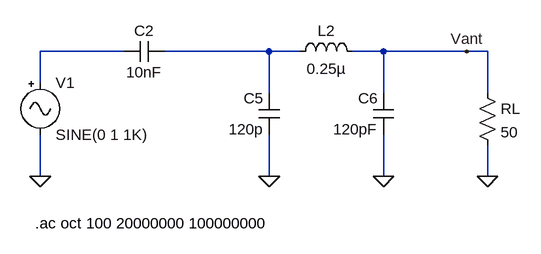
[diagram p0: schematic Draft1.asc]
Draft1.asc, the LTspice schematic file:
Version 4
SHEET 1 932 680
WIRE 320 288 192 288
WIRE 544 288 384 288
WIRE 592 288 544 288
WIRE 720 288 672 288
WIRE 848 288 720 288
WIRE 880 288 848 288
WIRE 192 336 192 288
WIRE 544 352 544 288
WIRE 720 352 720 288
WIRE 880 352 880 288
WIRE 192 480 192 416
WIRE 544 480 544 416
WIRE 720 480 720 416
WIRE 880 480 880 432
FLAG 192 480 0
FLAG 544 480 0
FLAG 720 480 0
FLAG 848 288 Vant
FLAG 880 480 0
SYMBOL cap 384 272 R90
WINDOW 0 0 32 VBottom 2
WINDOW 3 32 32 VTop 2
SYMATTR InstName C2
SYMATTR Value 10nF
SYMBOL cap 560 416 R180
WINDOW 0 24 56 Left 2
WINDOW 3 24 8 Left 2
SYMATTR InstName C5
SYMATTR Value 120p
SYMBOL cap 736 416 R180
WINDOW 0 24 56 Left 2
WINDOW 3 24 8 Left 2
SYMATTR InstName C6
SYMATTR Value 120pF
SYMBOL Ind 576 304 R270
WINDOW 0 32 56 VTop 2
WINDOW 3 5 56 VBottom 2
SYMATTR InstName L2
SYMATTR Value 0.25µ
SYMBOL Misc/signal 192 320 R0
SYMATTR InstName V1
SYMATTR Value2 AC 1 0
SYMBOL Res 864 336 R0
SYMATTR InstName RL
SYMATTR Value 50
TEXT 184 552 Left 2 !.ac oct 100 20000000 100000000

The netlist it stands for:
* Draft1.asc
C2 N002 N001 10nF
C5 0 N002 120p
C6 0 Vant 120pF
L2 N002 Vant 0.25µ
V1 N001 0 SINE(0 1 1K) AC 1 0
RL Vant 0 50
.ac oct 100 20000000 100000000
.backanno
.end